# EAGLE design Bit Reactor modular (EAGLE 6.6.0)
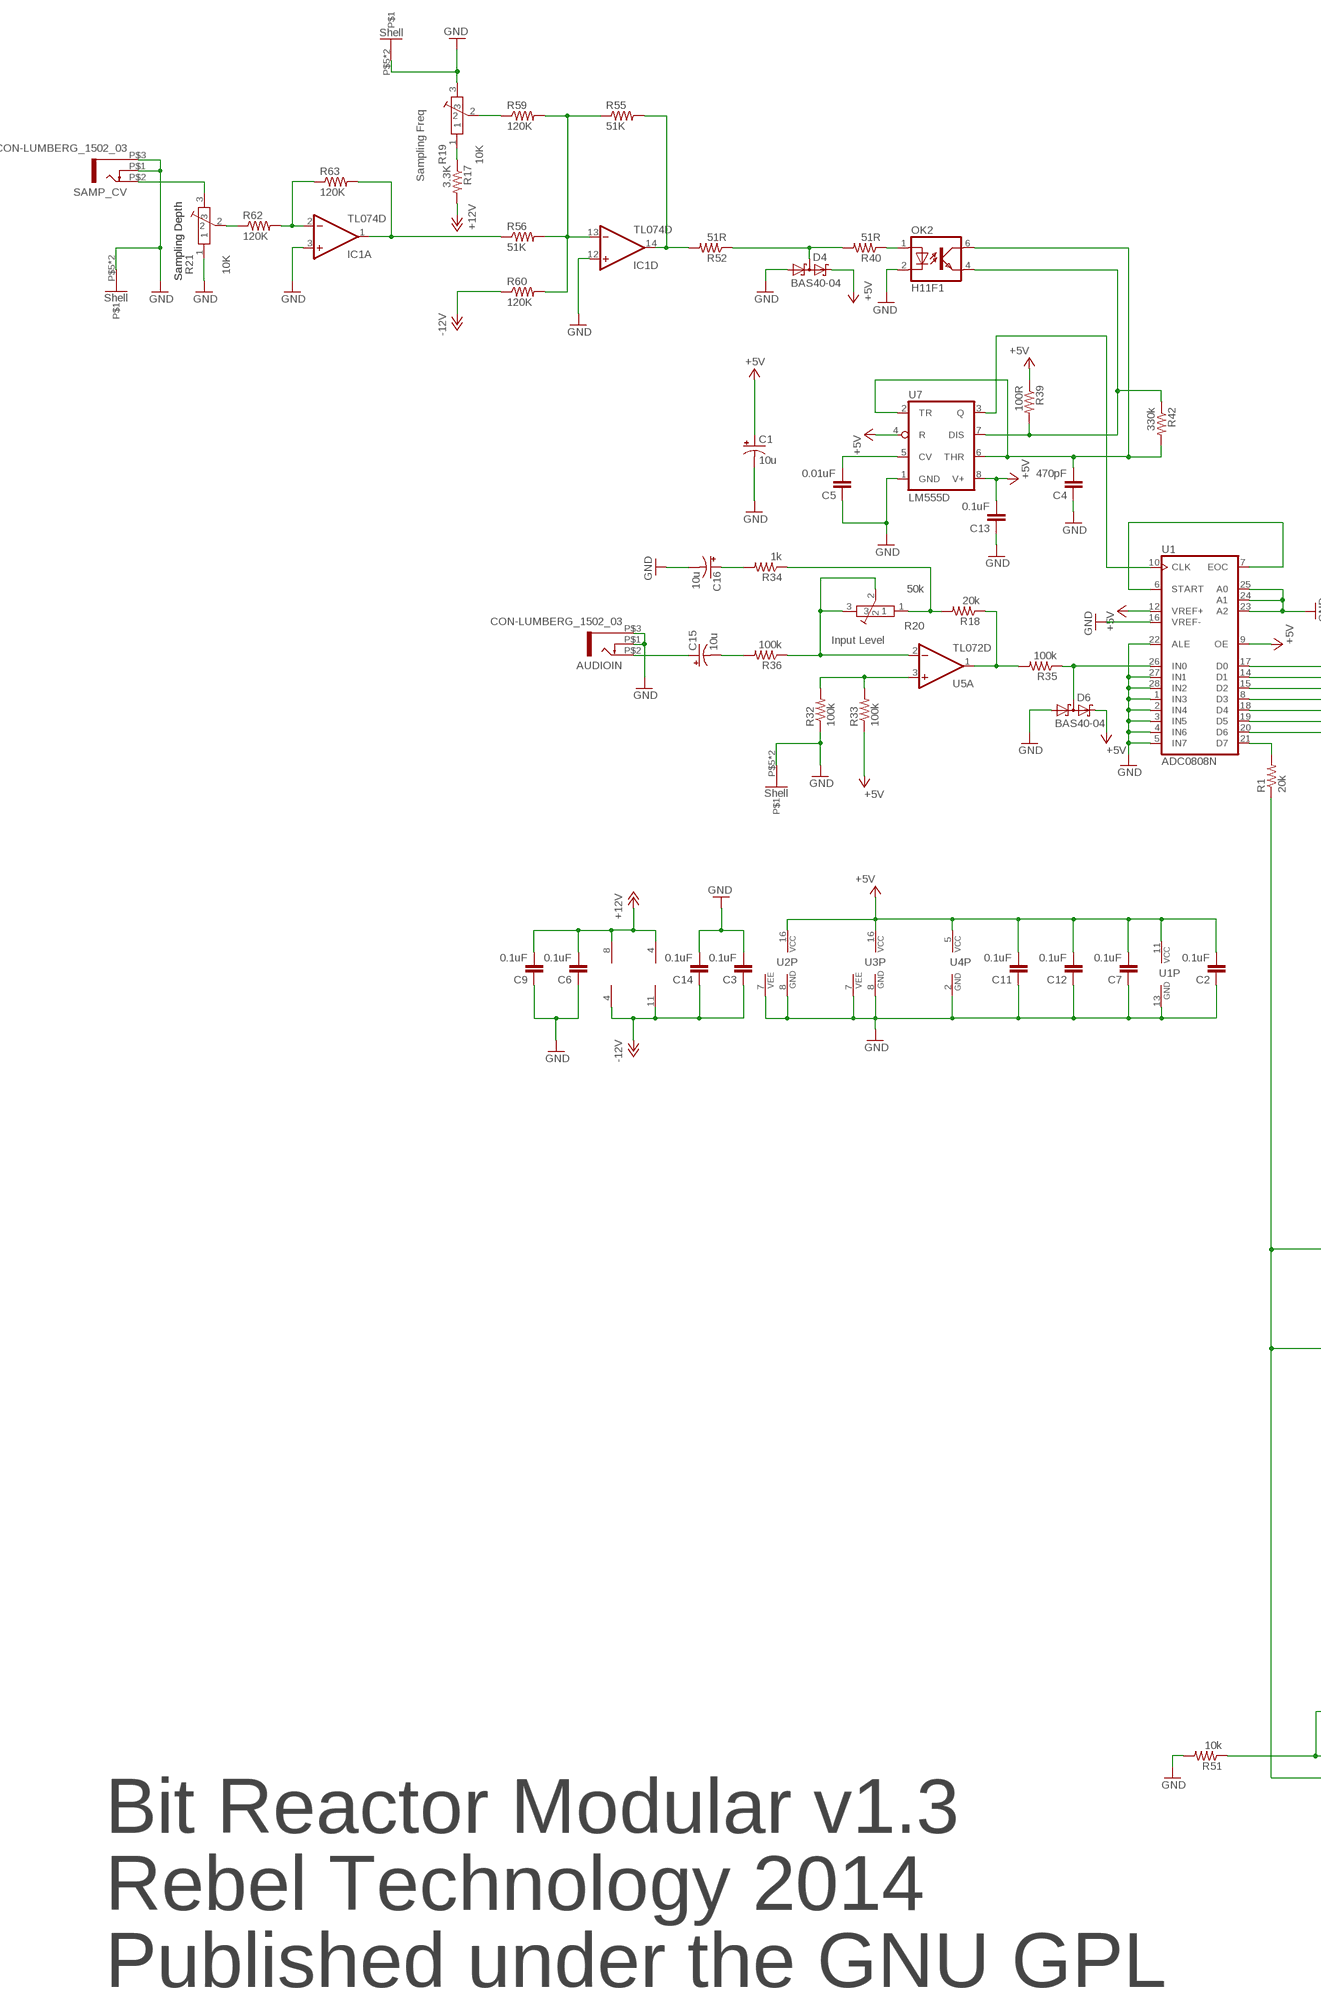
[diagram p0: schematic, sheet 1, part 1 of 2]
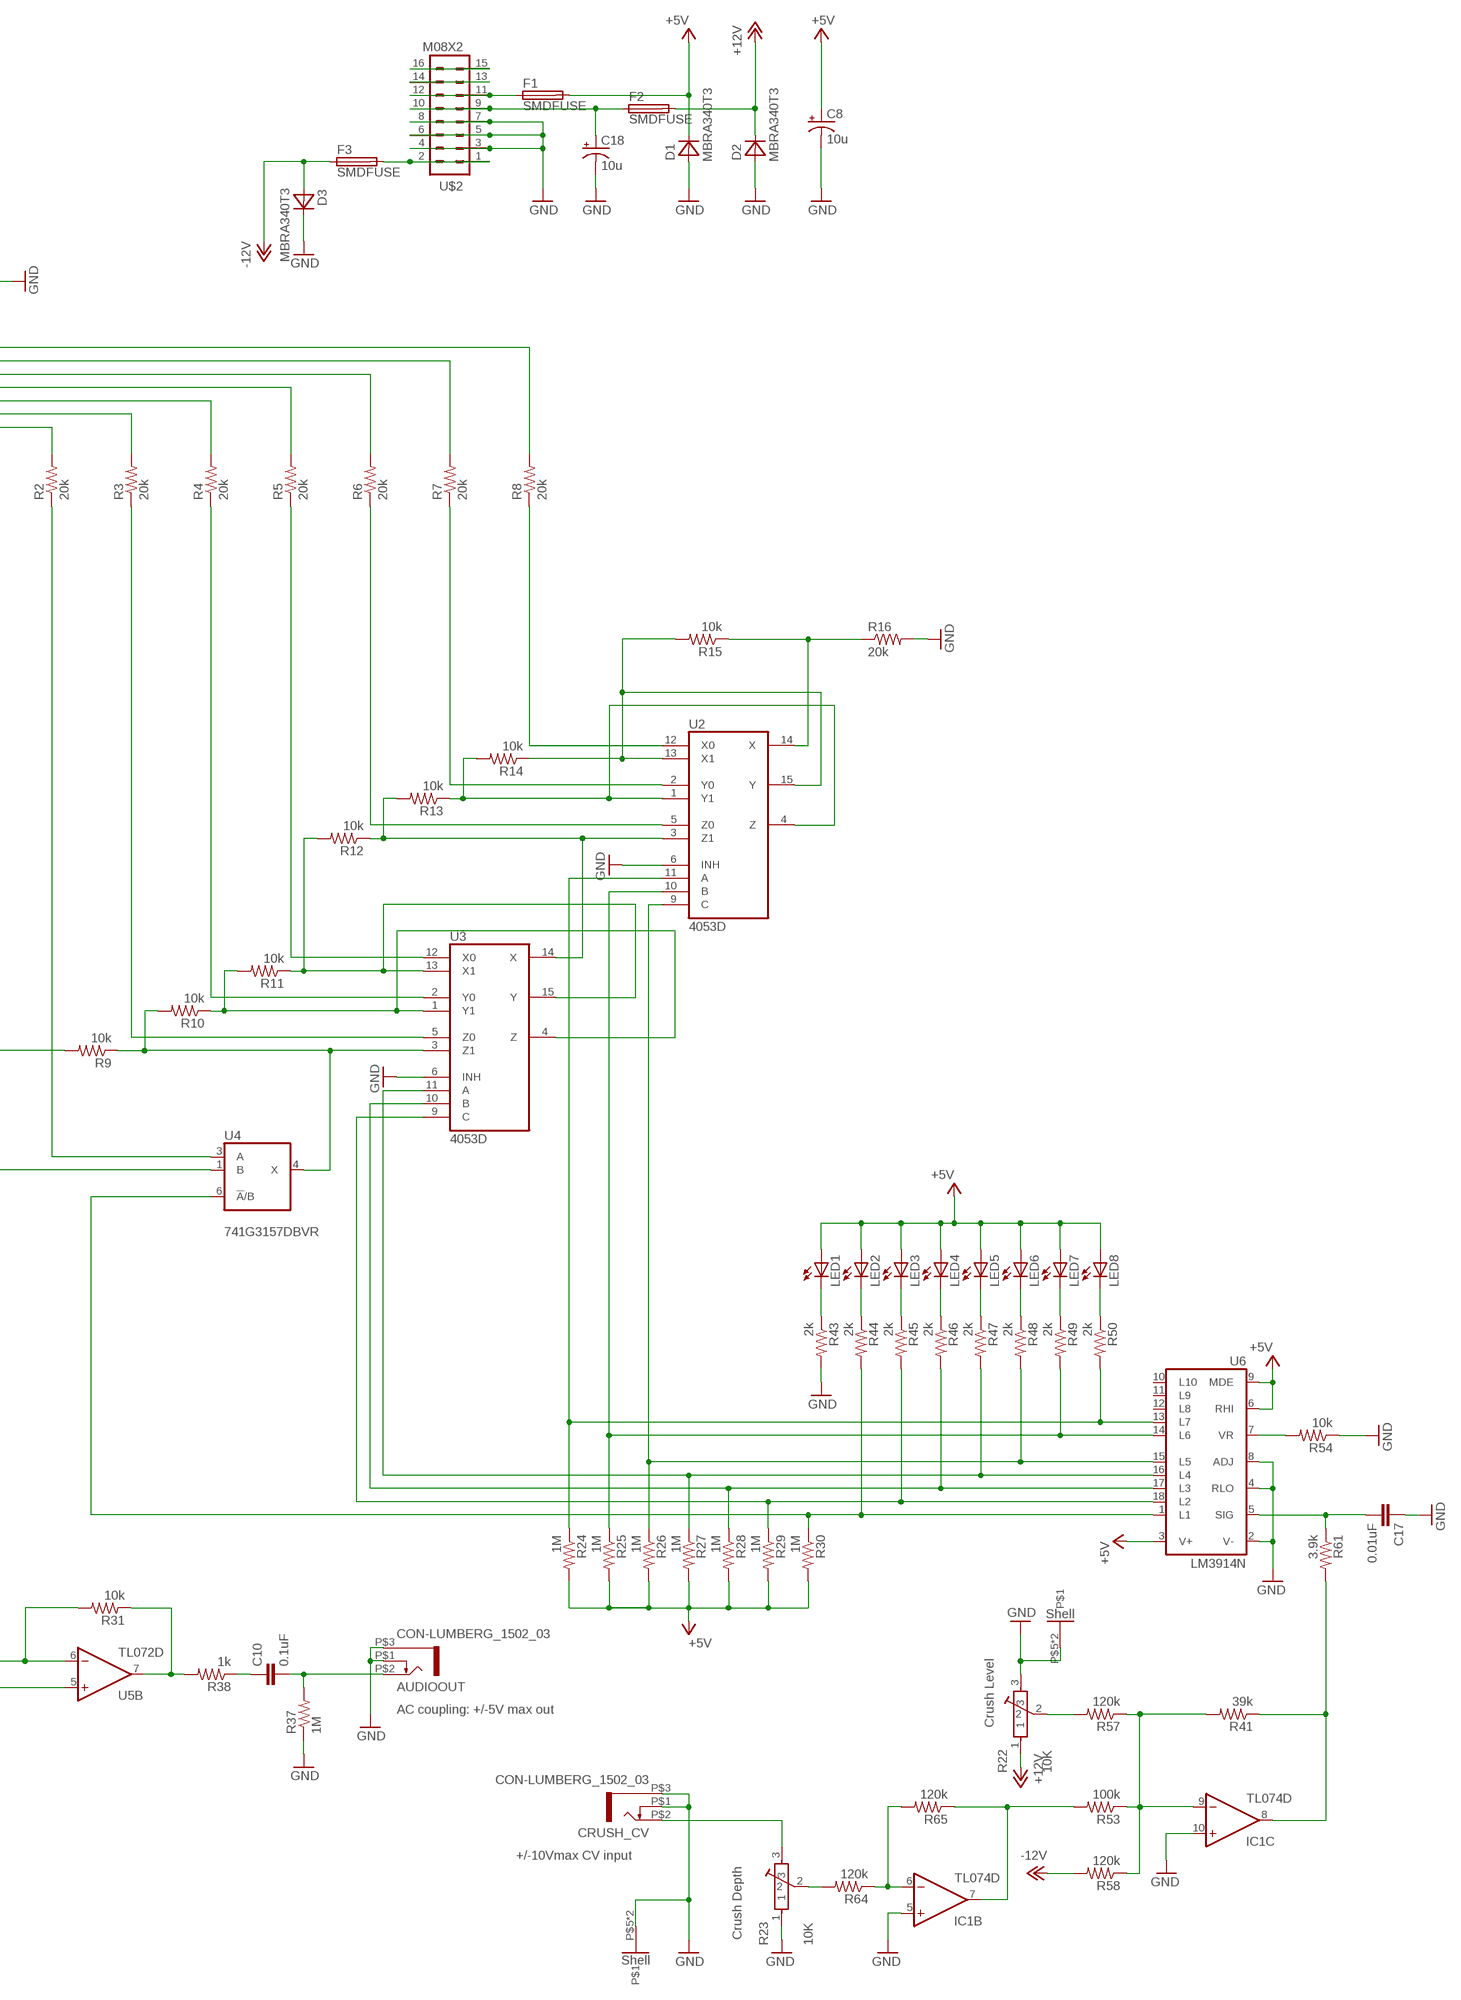
[diagram p1: schematic, sheet 1, part 2 of 2]

## Parts
AUDIOIN  CON-LUMBERG_1502_03  [CON-LUMBERG_1502_03]
AUDIOOUT  CON-LUMBERG_1502_03  [CON-LUMBERG_1502_03]
C1  10u  CPOL-USE2-5  [E2-5]
C2  0.1uF  C-EUC0402  [C0402]
C3  0.1uF  C-EUC0402  [C0402]
C4  470pF  C-EUC0402  [C0402]
C5  0.01uF  C-EUC0402  [C0402]
C6  0.1uF  C-EUC0402  [C0402]
C7  0.1uF  C-EUC0402  [C0402]
C8  10u  CPOL-USE2-5  [E2-5]
C9  0.1uF  C-EUC0402  [C0402]
C10  0.1uF  C-EUC0402  [C0402]
C11  0.1uF  C-EUC0402  [C0402]
C12  0.1uF  C-EUC0402  [C0402]
C13  0.1uF  C-EUC0402  [C0402]
C14  0.1uF  C-EUC0402  [C0402]
C15  10u  CPOL-USE2-5  [E2-5]
C16  10u  CPOL-USE2-5  [E2-5]
C17  0.01uF  C-EUC0402  [C0402]
C18  10u  CPOL-USE2-5  [E2-5]
CRUSH_CV  CON-LUMBERG_1502_03  [CON-LUMBERG_1502_03]
D1  MBRA340T3  [SMA]
D2  MBRA340T3  [SMA]
D3  MBRA340T3  [SMA]
D4  BAS40-04  [SOT23]
D6  BAS40-04  [SOT23]
F1  SMDFUSE  [1206]
F2  SMDFUSE  [1206]
F3  SMDFUSE  [1206]
IC1  TL074D  [SO14]
LED1  LED3MM  [LED3MM]
LED2  LED3MM  [LED3MM]
LED3  LED3MM  [LED3MM]
LED4  LED3MM  [LED3MM]
LED5  LED3MM  [LED3MM]
LED6  LED3MM  [LED3MM]
LED7  LED3MM  [LED3MM]
LED8  LED3MM  [LED3MM]
OK2  H11F1  [DIL05]
R1  20k  R-US_R0805  [R0805]
R2  20k  R-US_R0805  [R0805]
R3  20k  R-US_R0805  [R0805]
R4  20k  R-US_R0805  [R0805]
R5  20k  R-US_R0805  [R0805]
R6  20k  R-US_R0805  [R0805]
R7  20k  R-US_R0805  [R0805]
R8  20k  R-US_R0805  [R0805]
R9  10k  R-US_R0805  [R0805]
R10  10k  R-US_R0805  [R0805]
R11  10k  R-US_R0805  [R0805]
R12  10k  R-US_R0805  [R0805]
R13  10k  R-US_R0805  [R0805]
R14  10k  R-US_R0805  [R0805]
R15  10k  R-US_R0805  [R0805]
R16  20k  R-US_R0805  [R0805]
R17  3.3K  R-US_R0805  [R0805]
R18  20k  R-US_R0805  [R0805]
R19  10K  POT-ALPS-RK09L1140  [POT-ALPS-RK09L1140]
R20  50k  POT-ALPS-RK09L1140  [POT-ALPS-RK09L1140]
R21  10K  POT-ALPS-RK09L1140  [POT-ALPS-RK09L1140]
R22  10K  POT-ALPS-RK09L1140  [POT-ALPS-RK09L1140]
R23  10K  POT-ALPS-RK09L1140  [POT-ALPS-RK09L1140]
R24  1M  R-US_R0402  [R0402]
R25  1M  R-US_R0402  [R0402]
R26  1M  R-US_R0402  [R0402]
R27  1M  R-US_R0402  [R0402]
R28  1M  R-US_R0402  [R0402]
R29  1M  R-US_R0402  [R0402]
R30  1M  R-US_R0402  [R0402]
R31  10k  R-US_R0402  [R0402]
R32  100k  R-US_R0402  [R0402]
R33  100k  R-US_R0402  [R0402]
R34  1k  R-US_R0805  [R0805]
R35  100k  R-US_R0402  [R0402]
R36  100k  R-US_R0402  [R0402]
R37  1M  R-US_R0402  [R0402]
R38  1k  R-US_R0805  [R0805]
R39  100R  R-US_R1206  [R1206]
R40  51R  R-US_R1206  [R1206]
R41  39k  R-US_R0402  [R0402]
R42  330k  R-US_R0402  [R0402]
R43  2k  R-US_R0402  [R0402]
R44  2k  R-US_R0402  [R0402]
R45  2k  R-US_R0402  [R0402]
R46  2k  R-US_R0402  [R0402]
R47  2k  R-US_R0402  [R0402]
R48  2k  R-US_R0402  [R0402]
R49  2k  R-US_R0402  [R0402]
R50  2k  R-US_R0402  [R0402]
R51  10k  R-US_R0402  [R0402]
R52  51R  R-US_R1206  [R1206]
R53  100k  R-US_R0402  [R0402]
R54  10k  R-US_R0805  [R0805]
R55  51K  R-US_R0402  [R0402]
R56  51K  R-US_R0402  [R0402]
R57  120k  R-US_R0402  [R0402]
R58  120k  R-US_R0402  [R0402]
R59  120K  R-US_R0402  [R0402]
R60  120K  R-US_R0402  [R0402]
R61  3.9k  R-US_R0402  [R0402]
R62  120K  R-US_R0402  [R0402]
R63  120K  R-US_R0402  [R0402]
R64  120k  R-US_R0402  [R0402]
R65  120k  R-US_R0402  [R0402]
SAMP_CV  CON-LUMBERG_1502_03  [CON-LUMBERG_1502_03]
U1  ADC0808N  [DIL28-6]
U2  4053D  [SO16]
U3  4053D  [SO16]
U4  741G3157DBVR  [DBV_R-PDSO-G6]
U5  TL072D  [SO08]
U6  LM3914N  [DIL18]
U7  LM555D  [SO08]
U$2  M08X2  [2X8]

## Nets
+5V: C1.+ C2.2 C7.2 C8.+ C11.2 C12.2 C13.2 D1.C D4.2(C2) D6.2(C2) F1.2 LED1.A LED2.A LED3.A LED4.A LED5.A LED6.A LED7.A LED8.A R24.2 R25.2 R26.2 R27.2 R28.2 R29.2 R30.2 R33.1 R39.1 U1.9(OE) U1.11(VCC) U1.12(VREF+) U2.16(VCC) U3.16(VCC) U4.5(VCC) U6.3(V+) U6.6(RHI) U6.9(MDE) U7.4(R) U7.8(V+)
+12V: C6.2 C9.2 D2.C F2.2 IC1.4(P:V+) R17.2 R22.1 U5.8(P:V+)
-12V: C3.1 C14.1 D3.A F3.1 IC1.11(P:V-) R58.2 R60.1 U5.4(P:V-)
CV2IN: IC1.8(C:OUT) R41.1 R61.2
GND: AUDIOIN.P$1 AUDIOIN.P$3 AUDIOOUT.P$1 AUDIOOUT.P$3 C1.- C2.1 C3.2 C4.1 C5.1 C6.1 C7.1 C8.- C9.1 C11.1 C12.1 C13.1 C14.2 C16.- C17.1 C18.- CRUSH_CV.P$1 CRUSH_CV.P$3 D1.A D2.A D3.C D4.1(A1) D6.1(A1) IC1.3(A:+IN) IC1.5(B:+IN) IC1.10(C:+IN) IC1.12(D:+IN) OK2.2(C) R16.2 R19.3 R19.P$5 R19.P$6 R20.P$5 R20.P$6 R21.1 R21.P$5 R21.P$6 R22.3 R22.P$5 R22.P$6 R23.1 R23.P$5 R23.P$6 R32.1 R37.1 R43.2 R51.2 R54.1 SAMP_CV.P$1 SAMP_CV.P$3 U1.1(IN3) U1.2(IN4) U1.3(IN5) U1.4(IN6) U1.5(IN7) U1.13(GND) U1.16(VREF-) U1.22(ALE) U1.23(A2) U1.24(A1) U1.25(A0) U1.27(IN1) U1.28(IN2) U2.6(INH) U2.7(VEE) U2.8(GND) U3.6(INH) U3.7(VEE) U3.8(GND) U4.2(GND) U6.2(V-) U6.4(RLO) U6.8(ADJ) U7.1(GND) U$2.3 U$2.4 U$2.5 U$2.6 U$2.7 U$2.8
N$1: R1.2 U1.21(D7)
N$2: R2.2 U1.20(D6)
N$3: R3.2 U1.19(D5)
N$4: R4.2 U1.18(D4)
N$5: R5.2 U1.8(D3)
N$6: R6.2 U1.15(D2)
N$7: R7.2 U1.14(D1)
N$8: R8.2 U1.17(D0)
N$9: R17.1 R19.1
N$10: AUDIOIN.P$2 C15.+
N$11: C15.- R36.2
N$12: R13.1 R14.2 U2.1(Y1) U2.4(Z)
N$13: R5.1 U3.12(X0)
N$14: R4.1 U3.2(Y0)
N$15: R3.1 U3.5(Z0)
N$16: R2.1 U4.3(A)
N$17: R8.1 U2.12(X0)
N$18: R21.2 R62.1
N$19: IC1.2(A:-IN) R62.2 R63.1
N$20: R18.2 R20.1 R34.1
N$21: R7.1 U2.2(Y0)
N$22: R6.1 U2.5(Z0)
N$23: IC1.1(A:OUT) R56.1 R63.2
N$24: R12.1 R13.2 U2.3(Z1) U3.14(X)
N$25: R11.1 R12.2 U3.13(X1) U3.15(Y)
N$26: R10.1 R11.2 U3.1(Y1) U3.4(Z)
N$27: R9.1 R10.2 U3.3(Z1) U4.4(X)
N$28: R1.1 R9.2 U4.1(B) U5.5(B:+IN)
N$29: OK2.1(A) R40.1
N$30: U$2.13 U$2.14
N$31: R30.1 R44.2 U4.6(!A!/B) U6.1(L1)
N$32: R29.1 R45.2 U3.9(C) U6.18(L2)
N$33: R28.1 R46.2 U3.10(B) U6.17(L3)
N$34: R27.1 R47.2 U3.11(A) U6.16(L4)
N$35: R26.1 R48.2 U2.9(C) U6.15(L5)
N$36: R25.1 R49.2 U2.10(B) U6.14(L6)
N$37: R24.1 R50.2 U2.11(A) U6.13(L7)
N$38: R18.1 R35.2 U5.1(A:OUT)
N$39: R32.2 R33.2 U5.3(A:+IN)
N$40: R20.2 R20.3 R36.1 U5.2(A:-IN)
N$41: F1.1 U$2.11 U$2.12
N$42: R23.2 R64.2
N$43: R31.1 R38.2 U5.7(B:OUT)
N$44: C10.1 R38.1
N$45: U1.6(START) U1.7(EOC)
N$47: IC1.6(B:-IN) R64.1 R65.2
N$48: CRUSH_CV.P$2 R23.3
N$49: IC1.7(B:OUT) R53.2 R65.1
N$51: C18.+ F2.1 U$2.9 U$2.10
N$52: C5.2 U7.5(CV)
N$53: LED1.K(C) R43.1
N$54: U1.10(CLK) U7.3(Q)
N$55: R31.2 R51.1 U5.6(B:-IN)
N$56: LED2.K(C) R44.1
N$57: LED3.K(C) R45.1
N$58: LED4.K(C) R46.1
N$59: LED5.K(C) R47.1
N$60: LED6.K(C) R48.1
N$61: LED7.K(C) R49.1
N$62: LED8.K(C) R50.1
N$63: D6.3(C1A2) R35.1 U1.26(IN0)
N$65: R14.1 R15.2 U2.13(X1) U2.15(Y)
N$68: C16.+ R34.2
N$70: F3.2 U$2.1 U$2.2
N$71: IC1.13(D:-IN) R55.1 R56.2 R59.2 R60.2
N$72: R19.2 R59.1
N$73: IC1.14(D:OUT) R52.2 R55.2
N$75: R21.3 SAMP_CV.P$2
N$79: R54.2 U6.7(VR)
N$80: C17.2 R61.1 U6.5(SIG)
N$81: IC1.9(C:-IN) R41.2 R53.1 R57.1 R58.1
N$82: D4.3(C1A2) R40.2 R52.1
N$83: R22.2 R57.2
N$85: R15.1 R16.1 U2.14(X)
OUT: AUDIOOUT.P$2 C10.2 R37.2
PWR_BUS: U$2.15 U$2.16
Y: OK2.4(EMIT) R39.2 R42.1 U7.7(DIS)
Z: C4.2 OK2.6(COL) R42.2 U7.2(TR) U7.6(THR)
Unconnected: U6.10(L10) U6.11(L9) U6.12(L8)

## Notes on the sheet
- Sampling Freq
- Sampling Depth | Sampling Depth
- Input Level
- AC coupling: +/-5V max out
- Crush Level
- Bit Reactor Modular v1.3
- Rebel Technology 2014
- +/-10Vmax CV input
- Published under the GNU GPL | Crush Depth

## Library data of the parts
AUDIOIN AUDIOOUT CRUSH_CV SAMP_CV = Rebel:CON-LUMBERG_1502_03
C1 C8 C15 C16 C18 = resistor:CPOL-US: POLARIZED CAPACITOR, American symbol
C2-C7 C9-C14 C17 = resistor:C-EU: CAPACITOR, European symbol
D1-D3 = diode:MBRA340T3: Surface Mount Schottky Power Rectifier Source: http://www.onsemi.com/pub_link/Collateral/MBRA340T3-D.PDF
D4 D6 = diode:BAS40-04: Silicon Schottky Diodes General-purpose diode for high-speed switching
F1-F3 = fuse:SMDFUSE
IC1 = linear:TL074: OP AMP
LED1-LED8 = led:LED: LED OSRAM: - CHIPLED LG R971, LG N971, LY N971, LG Q971, LY Q971, LO R971, LY R971 LH N974, LH R974 LS Q976, LO Q976, LY Q976 LO Q996 - Hyper CHIPLED LW Q18S LB Q993, LB Q99A, LB R99A - SideLED LS A670, LO A670, LY A670, LG A670, LP A670 LB A673, LV A673, LT A673, LW A673 LH A674 LY A675 LS A676, LA A676, LO A676, LY A676, LW A676 LS A679, LY A679, LG A679 - Hyper Micro SIDELED® LS Y876, LA Y876, LO Y876, LY Y876 LT Y87S - SmartLED LW L88C, LW L88S LB L89C, LB L89S, LG L890 LS L89K, LO L89K, LY L89K LS L896, LA L896, LO L896, LY L896 - TOPLED LS T670, LO T670, LY T670, LG T670, LP T670 LSG T670, LSP T670, LSY T670, LOP T670, LYG T670 LG T671, LOG T671, LSG T671 LB T673, LV T673, LT T673, LW T673 LH T674 LS T676, LA T676, LO T676, LY T676, LB T676, LH T676, LSB T676, LW T676 LB T67C, LV T67C, LT T67C, LS T67K, LO T67K, LY T67K, LW E67C LS E67B, LA E67B, LO E67B, LY E67B, LB E67C, LV E67C, LT E67C LW T67C LS T679, LY T679, LG T679 LS T770, LO T770, LY T770, LG T770, LP T770 LB T773, LV T773, LT T773, LW T773 LH T774 LS E675, LA E675, LY E675, LS T675 LS T776, LA T776, LO T776, LY T776, LB T776 LHGB T686 LT T68C, LB T68C - Hyper Mini TOPLED® LB M676 - Mini TOPLED Santana® LG M470 LS M47K, LO M47K, LY M47K Source: http://www.osram.convergy.de LUXEON: - LUMILED® LXK2-PW12-R00, LXK2-PW12-S00, LXK2-PW14-U00, LXK2-PW14-V00 LXK2-PM12-R00, LXK2-PM12-S00, LXK2-PM14-U00 LXK2-PE12-Q00, LXK2-PE12-R00, LXK2-PE12-S00, LXK2-PE14-T00, LXK2-PE14-U00 LXK2-PB12-K00, LXK2-PB12-L00, LXK2-PB12-M00, LXK2-PB14-N00, LXK2-PB14-P00, LXK2-PB14-Q00 LXK2-PR12-L00, LXK2-PR12-M00, LXK2-PR14-Q00, LXK2-PR14-R00 LXK2-PD12-Q00, LXK2-PD12-R00, LXK2-PD12-S00 LXK2-PH12-R00, LXK2-PH12-S00 LXK2-PL12-P00, LXK2-PL12-Q00, LXK2-PL12-R00 Source: www.luxeon.com KINGBRIGHT: KA-3528ASYC Source: www.kingbright.com
OK2 = optocoupler:H11F1: OPTO COUPLER OPTO COUPLER; OC_FARNELL: unknown; OC_NEWARK: unknown
R1-R18 R24-R65 = resistor:R-US_: RESISTOR, American symbol
R19-R23 = Rebel:POT-ALPS-RK09L
U1 = linear:ADC0808: 8-bit A/D CONVERTER with 8-channel multiplexer
U2 U3 = 40xx:4053: Triple 2-channel ANALOG MULTIPLEXER
U4 = 74xx-little-us:74*1G3157: Single-Pole, Double-Throw Analog Switch Source: http://focus.ti.com/lit/ds/symlink/sn74lvc1g3157.pdf
U5 = linear:TL072: OP AMP
U6 = linear:LM3914N: LED DRIVER senses analog voltage levels and drives 10 LEDs
U7 = linear:*555: TIMER
U$2 = SparkFun:M08X2

## Board
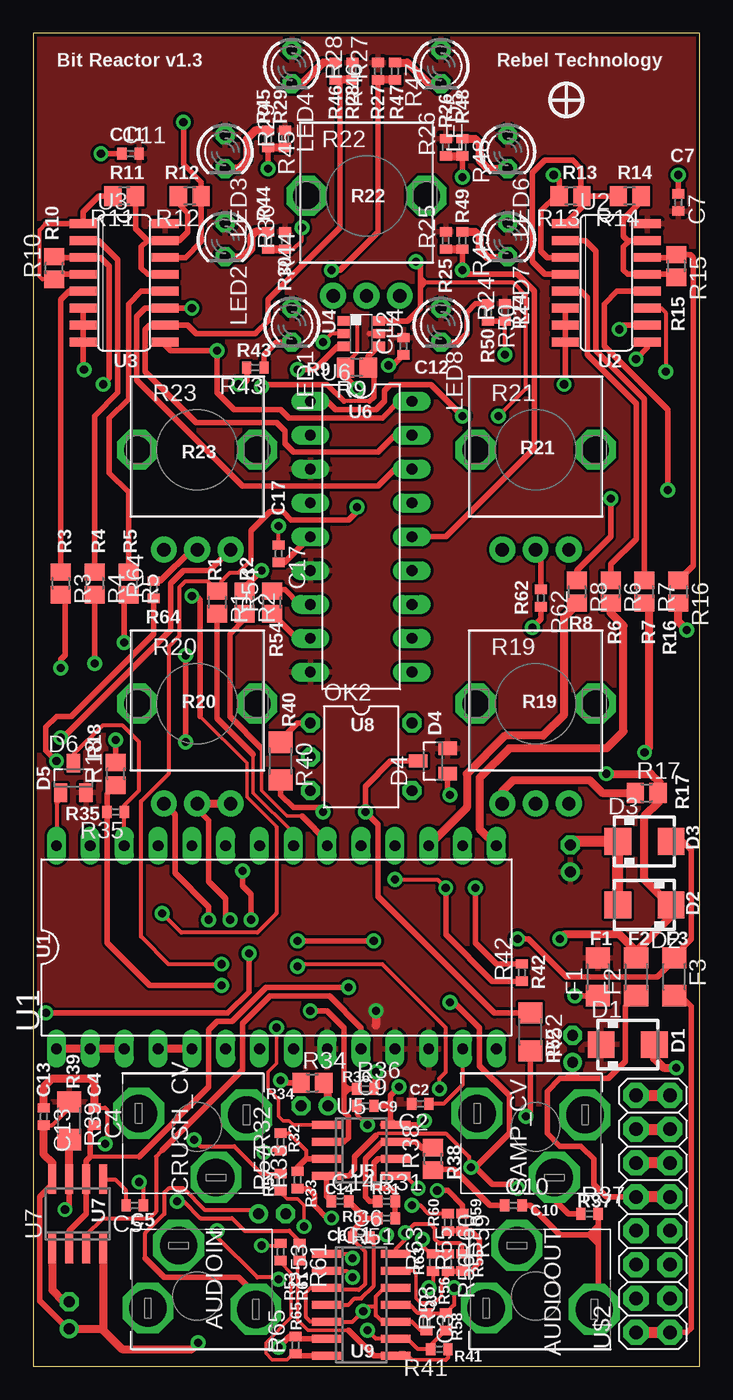
[diagram p2: board, top side]
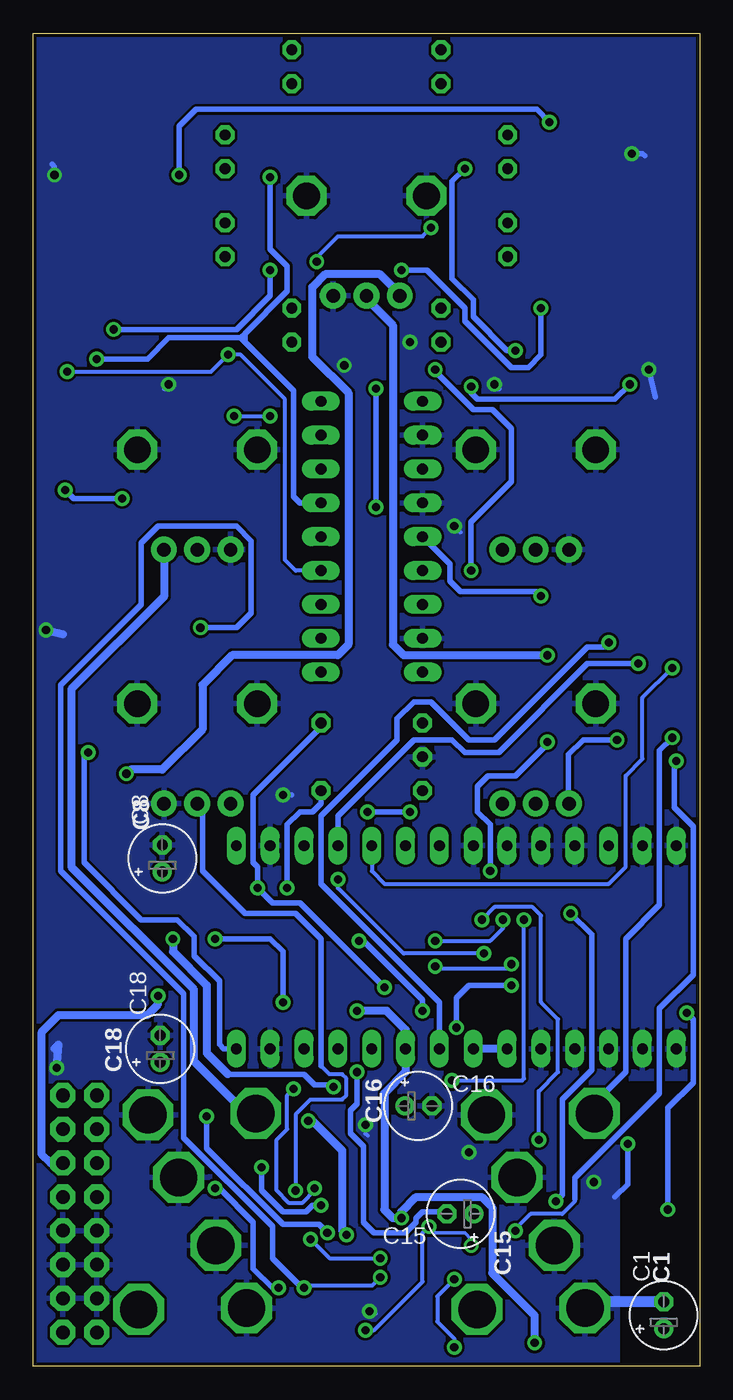
[diagram p3: board, bottom side, seen from below]

Size 50 x 100 mm. Coordinates in mm from the lower left corner, seen from the top.
Outline: 50,0 50,100 0,100 0,0 50,0
Copper layers (1*16): Top 0.035mm / dielectric 1.5mm / Bottom 0.035mm
Design rules "SparkFun": minimum track width 8mil, minimum drill 20mil, track to track 8mil, track to pad 8mil, pad to pad 8mil, via to via 8mil, smd to smd 8mil, copper to edge 10mil, drill to drill 8mil, minimum pad ring 12mil, minimum via ring 10mil, stop-mask expansion 4mil, vias tented up to drill 25mil, thermal gap 10mil

### Footprints (pad centres in the part's own frame; a part is rotated, then mirrored left to right if it is on the bottom)
CON-LUMBERG_1502_03 = drill 2.8 octagon: P$1 -3.8,-1.4; P$2 1,4.4; P$3 0.9,-3.7
E2-5 = drill 0.813 pad 1.27: + -1.016,0 | drill 0.813 pad 1.27 octagon: - 1.016,0
C0402 = smd 0.7 x 0.9: 1 -0.65,0; 2 0.65,0
SMA = smd 2 x 2: A 2,0; C -2,0
SOT23 = smd 1 x 1.4: 1 -0.95,-1.1; 2 0.95,-1.1; 3 0,1.1
1206 = smd 1.6 x 1.803: 1 -1.422,0; 2 1.422,0
SO14 = smd 0.6 x 2.2: 1 -3.81,-2.6; 2 -2.54,-2.6; 3 -1.27,-2.6; 4 0,-2.6; 5 1.27,-2.6; 6 2.54,-2.6; 7 3.81,-2.6; 8 3.81,2.6; 9 2.54,2.6; 10 1.27,2.6; 11 0,2.6; 12 -1.27,2.6; 13 -2.54,2.6; 14 -3.81,2.6
LED3MM = drill 0.813 octagon: A -1.27,0; K 1.27,0
DIL05 = drill 0.813 octagon: 1 -2.54,-3.81; 2 0,-3.81; 3 2.54,-3.81; 4 2.54,3.81; 6 -2.54,3.81
R0805 = smd 1.3 x 1.5: 1 -0.85,0; 2 0.85,0
POT-ALPS-RK09L1140 = drill 1 pad 1.93: 1 -2.5,-7.5; 2 0,-7.5; 3 2.5,-7.5 | drill 2 octagon: P$5 -4.5,0; P$6 4.5,0
R0402 = smd 0.7 x 0.9: 1 -0.65,0; 2 0.65,0
R1206 = smd 1.6 x 1.803: 1 -1.422,0; 2 1.422,0
DIL28-6 = drill 0.813 long: 1 -16.51,-7.62; 2 -13.97,-7.62; 3 -11.43,-7.62; 4 -8.89,-7.62; 5 -6.35,-7.62; 6 -3.81,-7.62; 7 -1.27,-7.62; 8 1.27,-7.62; 9 3.81,-7.62; 10 6.35,-7.62; 11 8.89,-7.62; 12 11.43,-7.62; 13 13.97,-7.62; 14 16.51,-7.62; 15 16.51,7.62; 16 13.97,7.62; 17 11.43,7.62; 18 8.89,7.62; 19 6.35,7.62; 20 3.81,7.62; 21 1.27,7.62; 22 -1.27,7.62; 23 -3.81,7.62; 24 -6.35,7.62; 25 -8.89,7.62; 26 -11.43,7.62; 27 -13.97,7.62; 28 -16.51,7.62
SO16 = smd 0.66 x 2.032: 1 -4.445,-3.073; 2 -3.175,-3.073; 3 -1.905,-3.073; 4 -0.635,-3.073; 5 0.635,-3.073; 6 1.905,-3.073; 7 3.175,-3.073; 8 4.445,-3.073; 9 4.445,3.073; 10 3.175,3.073; 11 1.905,3.073; 12 0.635,3.073; 13 -0.635,3.073; 14 -1.905,3.073; 15 -3.175,3.073; 16 -4.445,3.073
DBV_R-PDSO-G6 = smd 0.69 x 0.99: 1 -0.95,-1.29; 2 0,-1.29; 3 0.95,-1.29; 4 0.95,1.3; 5 0,1.3; 6 -0.95,1.3
SO08 = smd 0.6 x 2.2: 1 -1.905,-2.6; 2 -0.635,-2.6; 3 0.635,-2.6; 4 1.905,-2.6; 5 1.905,2.6; 6 0.635,2.6; 7 -0.635,2.6; 8 -1.905,2.6
DIL18 = drill 0.813 long: 1 -10.16,-3.81; 2 -7.62,-3.81; 3 -5.08,-3.81; 4 -2.54,-3.81; 5 0,-3.81; 6 2.54,-3.81; 7 5.08,-3.81; 8 7.62,-3.81; 9 10.16,-3.81; 10 10.16,3.81; 11 7.62,3.81; 12 5.08,3.81; 13 2.54,3.81; 14 0,3.81; 15 -2.54,3.81; 16 -5.08,3.81; 17 -7.62,3.81; 18 -10.16,3.81
2X8 = drill 1.016 pad 1.88 octagon: 1 0,0; 2 0,2.54; 3 2.54,0; 4 2.54,2.54; 5 5.08,0; 6 5.08,2.54; 7 7.62,0; 8 7.62,2.54; 9 10.16,0; 10 10.16,2.54; 11 12.7,0; 12 12.7,2.54; 13 15.24,0; 14 15.24,2.54; 15 17.78,0; 16 17.78,2.54

### Placement (x,y rotation side)
AUDIOIN  12.3,5.26 270 top
AUDIOOUT  37.7,5.26 270 top
C1  2.69,3.81 90 bottom
C2  29.04,19.68 180 top
C3  29.52,3.33 270 top
C4  4.6,18.73 270 top
C5  7.61,12.06 180 top
C6  24.6,9.68 0 top
C7  48.41,87.31 270 top
C8  40.32,38.1 90 bottom
C9  24.92,19.53 0 top
C10  36.03,12.06 0 top
C11  7.3,90.96 0 top
C12  27.77,76.52 90 top
C13  0.79,18.73 270 top
C14  23.01,12.38 0 top
C15  17.93,11.43 180 bottom
C16  21.11,19.53 0 bottom
C17  18.41,60.96 270 top
C18  40.48,23.81 90 bottom
CRUSH_CV  12.3,17.96 90 top
D1  44.6,24.13 0 top
D2  45.87,34.61 180 top
D3  45.87,39.37 0 top
D4  30,45.4 90 top
D6  3.01,44.13 0 top
F1  42.38,29.21 90 top
F2  45.24,29.21 90 top
F3  48.09,29.21 270 top
IC1  24.6,4.6 270 top
LED1  19.4,78.1 270 top
LED2  14.4,84.51 270 top
LED3  14.4,91.11 270 top
LED4  19.4,97.5 270 top
LED5  30.6,97.5 270 top
LED6  35.6,91.11 270 top
LED7  35.6,84.51 270 top
LED8  30.6,78.1 270 top
OK2  24.6,45.72 270 top
R1  13.8,57.31 270 top
R2  15.87,57.31 270 top
R3  2.06,58.74 270 top
R4  4.6,58.74 270 top
R5  7.14,58.74 270 top
R6  43.33,58.1 270 top
R7  45.87,58.1 270 top
R8  40.79,58.1 270 top
R9  24.28,74.93 180 top
R10  1.58,82.39 90 top
R11  6.82,87.79 180 top
R12  11.74,87.79 180 top
R13  40.32,87.79 180 top
R14  44.76,87.79 180 top
R15  48.25,82.55 270 top
R16  48.41,58.1 270 top
R17  46.03,43.02 0 top
R18  6.19,44.45 90 top
R19  37.7,49.71 0 top
R20  12.3,49.71 0 top
R21  37.7,68.76 0 top
R22  25,87.81 0 top
R23  12.3,68.76 0 top
R24  35.39,79.06 90 top
R25  30.95,84.45 90 top
R26  30.95,91.44 90 top
R27  25.87,97.16 90 top
R28  23.96,97.16 90 top
R29  18.88,92.08 90 top
R30  18.88,84.45 90 top
R31  26.5,12.38 0 top
R32  18.57,16.83 90 top
R33  19.84,13.97 90 top
R34  20.95,21.27 0 top
R35  6.19,41.59 180 top
R36  24.92,20.8 0 top
R37  41.74,11.43 0 top
R38  30,15.56 90 top
R39  2.69,18.41 270 top
R40  18.57,45.4 270 top
R41  30.47,1.27 180 top
R42  36.66,29.53 90 top
R43  16.66,74.93 180 top
R44  17.61,84.45 270 top
R45  17.61,92.08 270 top
R46  22.7,97.16 270 top
R47  27.14,97.16 270 top
R48  32.22,91.44 270 top
R49  32.22,84.45 270 top
R50  34.12,79.06 270 top
R51  26.5,11.11 180 top
R52  37.3,25.08 270 top
R53  18.57,8.57 270 top
R54  17.93,57.31 90 top
R55  32.22,7.78 90 top
R56  31.11,7.78 270 top
R57  18.57,13.81 90 top
R58  30.95,3.33 90 top
R59  32.22,10.79 270 top
R60  31.11,10.79 270 top
R61  20,8.57 270 top
R62  38.09,57.63 270 top
R63  30,7.78 90 top
R64  9.04,58.26 90 top
R65  19.68,1.59 90 top
SAMP_CV  37.7,17.96 90 top
U1  18.25,31.43 0 top
U2  43.02,81.28 270 top
U3  6.82,81.28 270 top
U4  24.6,77.47 270 top
U5  24.6,16.19 270 top
U6  24.6,62.23 270 top
U7  3.33,11.43 0 top
U$2  47.78,2.54 90 top

### Tracks (layer width: path | path; a pad name or v marks a point on that pad's centre or on a via)
+5V  (via drill 0.61)
  Top 0.305: C13.2 1.41,18.08 2.53,19.21 2.53,19.68 R39.1
  Top 0.406: 25.23,77.47 25.87,77.47 | U7.8 1.42,13.65 0.47,12.7 0.47,4.92 2.6,2.79 C1.+ | v22.38,11.11 22.06,11.11 21.11,12.06 21.11,12.86 20.65,13.32 R33.1
  Top 0.61: R39.1 3.01,19.68 | U7.8 1.42,15.24 0.79,15.88 C13.2 0.79,18.1 | U7.4 5.23,2.86 | 5.23,2.86 5.23,2.7 6.66,1.27 11.9,1.27 v12.38,1.75 | v25.71,26.67 25.71,25.56 | C1.+ 5.17,2.79 5.23,2.86
  Bottom 0.61: v12.38,1.75 12.38,3.81 15.55,6.99 15.55,11.91 16.34,12.7 21.27,12.7 22.38,11.59 v22.38,11.11 23.01,11.11 23.65,11.75 23.65,20.48 22.06,22.07 U1.9 22.06,25.24 23.49,26.67 v25.71,26.67
  pour Top: -0.17,99.69 -0.17,19.68 50,19.68 50,99.69
+12V  (via drill 0.61)
  Top 0.305: 27.14,18.1 U5.8 | 25.23,9.67 C6.2 | 25.39,9.54 C6.2 | C6.2 25.55,9.38 25.55,6.03 24.6,5.08 24.12,5.08 23.65,4.6 IC1.4
  Top 0.406: 26.82,19.84 26.82,19.21 | 26.82,19.21 26.82,18.48 U5.8 | 26.5,19.53 26.82,19.84 | 26.82,19.21 26.5,19.53 | 26.19,18.1 U5.8 | v29.36,18.41 29.04,18.1 U5.8 | 26.82,19.84 26.82,20.32 v27.46,20.95 | 26.5,19.53 C9.2 | C6.2 26.35,9.68 v26.5,9.84
  Top 0.61: 45.24,31.11 47.78,33.66 47.78,34.51 | 47.78,34.51 D2.C | 47.78,34.51 47.78,34.61 45.87,36.51 45.87,41.27 46.98,42.39 46.98,42.92 R17.2 46.98,43.12 46.98,43.81 46.35,44.45 v43.01,44.45 | F2.2 45.24,31.11 | 45.24,31.11 43.97,32.38 39.84,32.38 v39.52,32.07
  Bottom 0.406: 35.39,21.91 29.68,21.91 28.89,21.11 27.62,21.11 v27.46,20.95
  Bottom 0.61: 35.39,21.91 36.98,23.5 36.98,28.57 39.52,31.11 v39.52,32.07 | v29.36,18.41 29.04,18.41 26.82,16.19 26.82,10.16 v26.5,9.84 | R22.1 22.5,80.45 23.96,81.92 28.09,81.92 29.04,80.96 29.04,75.72 26.35,73.03 26.35,54.13 27.14,53.34 35.08,53.34 37.3,51.12 37.3,47.78 40.32,44.77 42.7,44.77 v43.01,44.45
-12V  (via drill 0.61)
  Top 0.254: 25.71,17.3 25.87,17.46 28.57,17.46
  Top 0.305: v28.41,12.06 29.04,12.06 29.66,11.45 R60.1 | 36.98,32.07 37.14,32.07 | R58.2 C3.1 28.87,3.98 28.25,4.6 IC1.11 | 28.57,17.46 30.95,17.46 32.7,15.72 32.7,15.08 v32.85,14.92 | v31.58,5.87 31.58,4.6 31.57,4.6 R58.2 | 31.11,4.13 30.96,4.13 R58.2
  Top 0.406: D3.A 48.73,39.37 49.36,38.73 49.36,32.07 48.09,30.8 F3.1 48.09,30.48 46.82,29.21 40,29.21 37.14,32.07 | 36.98,32.07 v36.35,32.07 | v31.27,27.3 31.58,27.3 33.49,25.4 33.49,22.54 35.71,20.32 35.71,17.46 33.17,14.92 | 22.36,12.4 22,12.76 U5.4 23.65,14.29 24.12,14.76 24.12,15.72 25.71,17.3 | 22.36,12.4 22.38,12.38 | 22.36,12.4 C14.1 22.38,12.37 | v32.85,14.92 33.17,14.92 | 33.17,14.92 34.44,13.65 36.03,13.65 v36.35,13.34
  Bottom 0.406: v36.35,32.07 32.22,32.07 31.27,31.11 v31.27,27.3 | v36.35,13.34 36.03,13.34 33.49,10.79 33.49,7.3 32.06,5.87 v31.58,5.87 | v32.85,14.92 32.85,13.18 31.27,11.59 29.52,11.59 29.04,12.06 v28.41,12.06
CV2IN
  Top 0.254: 30.95,0.48 28.41,0.48 | 23.65,2.7 20.63,2.7 19.84,3.49 19.84,7.78 20,7.94 R61.2 20.01,7.92
  Top 0.305: R41.1 31.12,0.65 30.95,0.48 | 28.41,0.48 27.93,0.95 27.46,0.95 27.3,0.79 IC1.8
  Top 0.406: IC1.8 25.55,0.79 23.65,2.7
GND  (via drill 0.61)
  Top 0.254: 23.95,10.13 C6.1
  Top 0.305: U4.2 22.38,77.47 v21.74,76.83 | U1.13 32.22,21.11 30.79,19.68 C2.1 29.68,19.68 | C9.1 24.27,18.91 v25.08,18.1 | D6.1 2.06,42.55 1.74,42.23 U1.28 | C4.1 5.38,19.38 5.55,19.21 5.55,16.83 v5.39,16.67 | C17.1 v18.41,63.02 | C5.1 8.26,13.48 v7.93,13.81 | 25.71,4.45 25.71,3.81 26.19,3.33 IC1.10 28.41,3.33 29.04,2.7 29.52,2.7 C3.2 | C6.1 23.96,9.53 24.92,8.57 24.92,6.19 24.44,5.71 22.16,5.71 IC1.3 20.79,5.87 20.47,5.56 20.47,3.65 20.79,3.33 IC1.5 23.96,3.33 v24.76,4.13 25.08,4.45 25.71,4.45 | R32.1 17.44,16.18 v17.3,16.03 | 25.71,4.45 25.71,5.24 26.35,5.87 IC1.12
  Top 0.406: U2.6 U2.7 U2.8 39.94,73.76 v39.84,73.66 | U3.8 3.75,78 | 3.75,78 3.64,78.11 | 3.75,78 U3.7 U3.6 | U3.8 3.64,76.83 | R43.2 16.03,74.92 16.03,73.98 15.71,73.66 v15.39,73.66 | U1.28 | R37.1 40.16,11.43 39.2,12.38 39.2,14.05 SAMP_CV.P$1 | R51.2 24.93,11.11 | 24.93,11.11 C14.2 | 23.95,10.13 24.93,11.11 | D4.1 31.1,43.03 v31.27,42.86 | C7.1 v48.41,89.38 | U3.8 3.75,74.83 v3.8,74.77 | C11.1 v5.07,90.96 | C12.1 27.76,75.87 26.98,75.09 v26.66,75.09 | U6.8 19.78,54.61 R54.1
  Top 0.61: U1.5 U1.4 | U1.3 U1.2 U1.1 | C13.1 0.79,20.95 1.42,21.59 4.28,21.59 4.6,21.27 C4.1 | v49.05,55.24 48.41,55.88 R16.2 | U7.1 1.42,5.71 2.22,4.92 2.6,4.92 C1.- | D1.A 46.6,23.08 47.3,22.38 v48.25,22.38
  Top 0.813: D2.A D3.C 40.63,39.37 40.32,39.05 C8.-
  Bottom 0.305: v25.08,18.1 25.08,17.46 24.92,17.3 | v18.41,63.02 17.93,62.55 | v24.76,4.13 24.6,4.29 24.28,3.97
  Bottom 0.406: v39.84,73.66 40.16,73.34 | v3.8,74.77 3.33,72.71 | v15.39,73.66 15.07,73.34 | v31.27,42.86 30.63,42.86 | v5.39,16.67 5.39,13.65 6.34,12.7 | v48.41,89.38 48.41,90.01 48.57,90.17 | v5.07,90.96 4.28,90.96 4.12,90.81
  Bottom 0.61: v48.25,22.38 48.09,24.13 48.41,23.81 | v49.05,55.24 47.78,54.93
  Bottom 0.813: C1.- 8.13,4.83 AUDIOIN.P$3
  pour Bottom: 6.19,0 6.19,21.59 0.47,21.59 0.47,99.69 50,99.69 50,0
N$1
  Top 0.254: U1.21 19.52,40.01 16.5,43.02 16.5,45.88
  Top 0.406: 16.5,45.88 13.8,48.58 R1.2
N$2
  Top 0.254: 20.15,41.27 19.04,41.27 17.14,43.18 17.14,46.35
  Top 0.305: R2.2 16.29,56.46 16.34,56.52
  Top 0.406: U1.20 22.06,39.37 20.15,41.27 | 16.34,56.52 16.34,56.62 | 17.14,46.35 14.76,48.74 14.76,54.93 15.87,56.04 R2.2
N$3  (via drill 0.61)
  Top 0.406: v2.06,52.39 2.06,53.02 2.37,53.34 2.37,57.78 2.06,58.1 R3.2
  Bottom 0.305: U1.19 24.6,37.15 23.65,36.2 6.82,36.2 5.55,37.47 5.55,44.29 4.28,45.56 4.28,50.16 v2.06,52.39
N$4  (via drill 0.61)
  Top 0.406: v4.6,52.7 R4.2
  Bottom 0.406: U1.18 27.14,41.27 21.42,46.99 18.57,46.99 17.61,46.04 15.07,46.04 8.41,52.7 v4.6,52.7
N$5  (via drill 0.61)
  Top 0.406: v6.82,54.29 6.82,57.57 R5.2
  Bottom 0.406: U1.8 19.52,27.3 28.41,36.2 28.41,41.27 22.69,46.99 22.69,48.58 21.42,49.85 20.15,49.85 17.3,46.99 15.39,46.99 8.41,53.98 7.14,53.98 v6.82,54.29
N$6
  Top 0.61: U1.15 33.49,40.32 33.49,44.13 35.71,46.35 43.01,46.35 44.28,47.62 44.28,55.56 43.33,56.52 R6.2
N$7  (via drill 0.61)
  Top 0.61: R7.2 46.19,56.94 46.19,46.35 v45.87,46.04
  Bottom 0.406: U1.14 35.71,23.81 36.03,24.13 36.03,28.89 37.93,30.8 37.93,32.23 39.2,33.5 41.9,33.5 46.19,37.78 46.19,45.72 v45.87,46.04
N$8
  Top 0.61: U1.17 32.54,41.91 32.54,44.45 35.39,47.31 38.25,47.31 39.84,48.9 39.84,56.2 40.79,57.15 R8.2
N$9
  Top 0.61: R19.1 35.2,43.14 36.03,43.97 41.74,43.97 42.7,43.02 R17.1 45.24,43.02
N$10
  Top 0.305: 8.41,8.1 8.41,10 9.84,11.43 9.84,13.02 10.15,13.34 11.26,13.34 12.85,11.75 16.6,11.75 C15.+
  Top 0.406: AUDIOIN.P$2 16.7,5.36 15.39,6.67 9.84,6.67 8.41,8.1
N$11  (via drill 0.61)
  Top 0.61: v25.71,22.07 25.71,20.94 R36.2
  Bottom 0.406: v25.71,22.07 25.71,19.68 26.19,19.21 26.19,17.46 25.23,16.51 25.23,10.79 24.44,10 22.06,10 21.27,10.79 21.27,11.11 20.79,11.59 19.11,11.59 C15.-
N$12
  Top 0.406: R13.1 41.17,86.95 U2.1 | R14.2 R13.1 | U2.4 38.41,81.92 37.46,82.87 37.46,89.53 38.41,90.49 40.47,90.49 41.11,89.85 41.11,87.95 41.03,87.87 | 41.03,87.87 40.95,87.79 | R13.1 41.11,87.79 41.03,87.87
N$13
  Top 0.406: R5.1 7.14,65.56 5.71,66.99 5.71,71.12 7.14,72.55 7.14,79.69 8.09,80.64 U3.12
N$14
  Top 0.406: R4.1 4.6,71.28 6.34,73.03 6.34,83.03 4.91,84.45 U3.2
N$15
  Top 0.406: R3.1 2.06,80.01 2.69,80.64 U3.5
N$16  (via drill 0.61)
  Top 0.406: 23.31,76.5 U4.3 22.86,76.52 21.11,74.77 v19.84,74.77 | R2.1 15.87,58.42 v17.14,59.69
  Bottom 0.406: v19.84,74.77 19.84,74.61 16.98,71.75 15.55,71.75 14.12,70.33 14.12,66.36 17.14,63.34 v17.14,59.69
N$17  (via drill 0.61)
  Top 0.406: U2.12 43.81,80.64 42.86,79.69 42.86,76.52 47.62,71.75 v47.62,65.72 | R8.1 40.79,59.69 43.33,62.23 v43.33,65.09
  Bottom 0.406: v43.33,65.09 46.98,65.09 v47.62,65.72
N$18
  Top 0.406: R62.1 38.09,60.8 37.62,61.28 37.68,61.28 R21.2
N$19  (via drill 0.61)
  Top 0.305: IC1.2 23.49,7.14 v23.96,6.67 | R63.1 30,6.19 v29.68,5.87
  Top 0.406: R62.2 38.09,56.04 v37.46,55.4
  Bottom 0.305: v23.96,6.67 24.6,6.03 29.52,6.03 v29.68,5.87
  Bottom 0.406: v37.46,55.4 34.76,55.4 33.65,56.52 33.65,61.91 34.76,63.02 40.63,63.02 41.9,61.75 41.9,57.15 47.94,51.12 47.94,37.15 38.73,27.94 38.73,17.14 32.06,10.48 32.06,8.1 29.84,5.87 v29.68,5.87
N$20  (via drill 0.61)
  Top 0.406: R20.1 10.63,41.38 10.63,36.99 13.17,34.45 v13.17,33.5 | R34.1 18.73,21.27 v18.57,21.43 | R18.2 v6.18,46.99
  Bottom 0.305: v13.17,33.5 13.17,21.59 13.33,21.43 v18.57,21.43
  Bottom 0.406: v6.18,46.99 8.72,46.99 9.84,45.88 9.84,42.23 9.82,42.23 R20.1
N$21
  Top 0.406: R7.1 45.87,72.55 42.22,76.2 42.22,83.66 41.43,84.45 U2.2
N$22
  Top 0.406: R6.1 43.33,60.17 45.24,62.07 45.24,72.23 41.59,75.88 41.59,80.17 41.11,80.64 U2.5
N$23  (via drill 0.61)
  Top 0.305: 21.9,8.41 IC1.1 23.65,8.41 v23.96,8.1 | R63.2 29.82,8.43 29.2,9.05 v29.2,9.53
  Top 0.406: R56.1 R63.2
  Bottom 0.305: v23.96,8.1 27.77,8.1 v29.2,9.53
N$24  (via drill 0.61)
  Top 0.406: 9.84,83.19 U3.14 11.42,83.19 12.59,84.35 R12.1 12.59,88.84 11.26,90.17 v11.26,93.34 | U2.3 38.57,83.19 38.09,83.66 38.09,86.68 39.2,87.79 R13.2 39.47,88.96 v39.05,89.38
  Bottom 0.406: v39.05,89.38 39.05,93.03 37.78,94.3 12.22,94.3 v11.26,93.34
N$25
  Top 0.406: U3.13 8.57,81.92 8.09,82.39 8.09,83.98 8.57,84.45 | 8.57,84.45 U3.15 10.95,84.45 11.58,85.09 11.58,86.52 10.89,87.21 R12.2 | R11.1 7.67,85.35 8.57,84.45
N$26
  Top 0.305: R10.1 0.68,81.54 0.47,81.76 0.47,85.25 0.95,85.72
  Top 0.406: U3.4 1.9,81.92 1.42,81.44 R10.1 | R11.2 4.91,87.79 3.75,86.62 U3.1 0.95,85.72
N$27  (via drill 0.61)
  Top 0.305: 25.23,72.39 23.33,72.39
  Top 0.406: R10.2 1.57,83.19 U3.3 5.07,83.19 5.71,82.55 5.71,74.14 v5.23,73.66 | R9.1 25.13,75.14 | U4.4 25.13,75.75 25.13,75.14 | 25.13,75.14 25.08,75.09 25.08,74.77 25.55,74.3 25.55,72.71 25.23,72.39 | 23.33,72.39 22.06,73.66 17.3,73.66 v17.14,73.5
  Bottom 0.406: v17.14,73.5 17.14,73.03 16.66,72.55 6.34,72.55 v5.23,73.66
N$28  (via drill 0.61)
  Top 0.305: 27.77,14.29 27.93,14.29 v28.89,13.34 | v30.47,20.8 30.47,21.59 30.95,22.07 30.95,25.4 26.19,30.16 20,30.16 v19.84,30 | v14.12,30.16 10.15,30.16 8.09,32.23 8.09,42.39 10.15,44.45 10.15,53.98 10.95,54.77 10.95,58.42 11.42,58.9 13.07,58.9 R1.1 | U4.1 24.13,78.42 24.28,78.26 24.28,76.04 23.65,75.41 23.65,75.14 | 14.12,58.48 14.12,58.9 14.76,59.53 15.39,59.53 16.34,60.48
  Top 0.406: U5.5 27.77,14.29 | 23.65,75.14 R9.2 23.43,74.19 v24.28,73.34 | v24.28,64.45 24.28,64.14 23.65,63.5 19.36,63.5 18.73,64.14 17.77,64.14 16.34,62.71 16.34,60.48 | 14.12,58.48 R1.1
  Bottom 0.305: v28.89,13.34 28.89,13.18 29.84,12.22 30.79,12.22 31.74,13.18 31.74,16.99 30.95,17.78 30.95,20.32 v30.47,20.8 | v14.12,30.16 14.44,29.84 19.68,29.84 v19.84,30
  Bottom 0.406: v24.28,73.34 v24.28,64.45
N$29
  Top 0.406: OK2.1 19.84,48.26 18.57,46.99 R40.1
N$30
  Top 0.813: U$2.14 U$2.13
N$31  (via drill 0.61)
  Top 0.305: R30.1 19.5,83.81 20.15,84.45 v20.15,85.41 | 29.36,81.28 36.03,81.28 36.98,80.33 36.98,73.34 v34.92,71.28
  Top 0.406: 29.04,80.96 29.04,79.38 28.09,78.42 U4.6 | 29.04,80.96 29.04,81.28 | 29.04,81.28 29.04,81.6 | 29.04,81.6 29.04,82.55 v28.73,82.87 | U6.1 22.06,72.39 22.69,71.75 25.71,71.75 26.35,72.39 26.35,73.18 26.82,73.66 29.84,73.66 v32.22,71.28 | 29.36,81.28 29.04,81.28 | 29.36,81.28 29.04,81.6 | 29.36,81.28 29.04,80.96
  Top 0.61: R44.2 R30.1
  Bottom 0.305: v20.15,85.41 20.79,84.77 27.14,84.77 28.73,83.19 v28.73,82.87 | v34.92,71.28 v32.22,71.28
N$32  (via drill 0.61)
  Top 0.406: R45.2 v17.61,89.85 | U3.9 9.89,76.62 10.31,76.2 v13.8,76.2 13.8,73.03 15.07,71.75 18.57,71.75 19.2,71.12 26.19,71.12 27.46,72.39 U6.18
  Top 0.61: R29.1 R45.2
  Bottom 0.406: v17.61,89.85 18.57,88.9 18.57,81.6 16.98,80.01 16.98,78.74 14.44,76.2 v13.8,76.2
N$33
  Top 0.406: R46.2 22.69,96.52 23.01,96.2 23.01,85.41 17.61,80.01 17.61,78.42 16.66,77.47 12.22,77.47 11.58,78.11 U3.10 8.72,78.11 8.41,77.79 8.41,74.61 12.22,70.8 18.25,70.8 18.88,70.17 18.88,69.22 19.52,68.58 25.87,68.58 27.14,69.85 U6.17
  Top 0.61: R28.1 R46.2
N$34  (via drill 0.61)
  Top 0.406: R27.1 25.87,85.09 23.01,82.23 v22.38,82.23 | v11.9,79.38 U3.11 8.41,79.38 7.77,78.74 7.77,73.98 15.71,66.04 25.87,66.04 27.14,67.31 U6.16
  Top 0.61: R47.2 R27.1
  Bottom 0.406: v11.9,79.38 11.9,75.88 12.85,74.93 14.12,74.93 17.61,78.42 17.61,79.38 20.47,82.23 v22.38,82.23
N$35  (via drill 0.61)
  Top 0.406: U2.9 46.09,76.42 v45.24,75.56 | R48.2 v32.22,89.22
  Top 0.61: R26.1 R48.2
  Bottom 0.406: v45.24,75.56 41.43,75.56 39.84,77.15 34.44,77.15 | v32.22,89.22 32.22,83.82 30.95,82.55 30.95,80.64 34.12,77.47 | 34.12,77.47 34.44,77.15 | 34.12,76.83 30.47,73.18 30.47,65.25 30,64.77 U6.15 | 34.12,76.83 34.44,77.15 | 34.12,76.83 34.12,77.47
N$36  (via drill 0.61)
  Top 0.406: U2.10 44.28,78.11 v43.97,77.79 | R49.2 v32.22,82.23 32.54,81.92 36.35,81.92 37.62,80.64 37.62,68.9 30.95,62.23 U6.14
  Top 0.61: R25.1 R49.2
  Bottom 0.406: v43.97,77.79 34.76,77.79 32.22,80.33 v32.22,82.23
N$37  (via drill 0.61)
  Top 0.305: U2.11 47.14,79.38 47.46,79.06 v47.46,74.61 | v35.39,75.88 R24.1
  Top 0.406: R50.2 35.38,78.41 35.39,78.42 R24.1
  Bottom 0.305: v47.46,74.61 36.66,74.61 v35.39,75.88 34.44,75.88 31.11,72.55 31.11,60.48 30.31,59.69 U6.13
N$38  (via drill 0.61)
  Top 0.254: v18.25,25.4 18.25,22.7 17.61,22.07 17.61,20.8 18.41,20 18.41,18.73 18.73,18.41 19.2,18.41 19.52,18.1 U5.1
  Top 0.406: v14.12,28.57 8.72,28.57 5.55,31.75 5.55,41.58 R35.2 5.53,42.95 R18.1
  Bottom 0.406: v18.25,25.4 18.25,27.62 17.3,28.57 v14.12,28.57
N$39
  Top 0.305: R32.2 19.19,17.48 20.47,16.19 20.47,15.56
  Top 0.406: U5.3 20.47,15.56 19.84,14.92 R33.2
N$40  (via drill 0.61)
  Top 0.406: U5.2 23.33,16.83 23.65,17.14 23.65,18.73 23.33,19.05 23.33,20.48 | 23.33,20.48 23.65,20.8 | 24.28,20.95 R36.1 23.65,20.8 | 23.33,20.48 23.33,21.11 | 23.33,21.11 23.33,25.4 22.06,26.67 v20.79,26.67 | 23.65,20.8 23.33,21.11 | R20.2 12.3,41.83 13.17,40.96 13.17,36.35 14.44,35.08 14.44,33.81 v14.76,33.5 | v25.55,31.91 v19.84,31.91
  Top 0.61: R20.2 R20.3
  Bottom 0.305: v14.76,33.5 14.76,32.86 15.71,31.91 v19.84,31.91
  Bottom 0.406: v20.79,26.67 20.79,27.46 25.23,31.91 v25.55,31.91
N$41  (via drill 0.61)
  Top 0.406: F1.1 v40.64,27.79 v40.63,27.78
  Top 0.813: U$2.11 U$2.12
  Bottom 0.61: U$2.11 48.73,15.24 49.36,15.88 49.36,25.08 48.09,26.35 41.43,26.35 40.63,27.15 v40.63,27.78
N$42
  Top 0.406: R64.2 9.53,58.91 11.9,61.28 12.32,61.28 | 12.38,61.28 12.32,61.28 | 12.32,61.28 R23.2
N$43
  Top 0.406: R31.1 25.23,12.38 24.92,12.7 24.92,15.56 26.19,16.83 U5.7 28.73,16.83 29.2,16.35 29.94,16.35 R38.2
N$44
  Top 0.406: R38.1 30,14.76 31.58,14.76 34.28,12.06 C10.1
N$45
  Bottom 0.61: U1.6 U1.7
N$46
  Top 0.406: 24.6,10.79 24.6,11.43
N$47  (via drill 0.61)
  Top 0.305: v13.8,10.16 13.8,9.68 16.82,6.67 18.25,6.67 v18.41,6.51
  Top 0.406: R64.1 9.04,54.93 2.85,48.74 1.74,48.74 0.95,47.94 0.95,46.2 v1.74,45.4 | IC1.6 19.85,2.06 R65.2 19.22,2.24 v18.41,1.43
  Bottom 0.305: 9.36,12.54 9.36,12.38 10.31,11.43 12.69,11.43 13.8,10.32 v13.8,10.16 | v18.41,6.51 19.68,5.24 19.68,3.33 18.41,2.06 v18.41,1.43
  Bottom 0.406: v1.74,45.4 1.9,45.24 1.9,41.91 0.47,40.48 0.47,29.37 3.01,26.83 3.01,20.48 9.36,14.13 9.36,12.54
N$48  (via drill 0.61)
  Top 0.406: R23.3 13.23,59.69 11.26,59.69 10.31,58.74 10.31,55.24 2.22,47.15 v2.06,47.15
  Bottom 0.406: CRUSH_CV.P$2 7.9,19.72 5.55,22.07 5.55,32.07 3.01,34.61 3.01,46.2 v2.06,47.15
N$49
  Top 0.254: R65.1 19.5,0.94 19.04,0.48 17.93,0.48 17.46,0.95 17.46,1.75 19.36,3.65 19.36,6.99 18.57,7.78 R53.2
  Top 0.406: IC1.7 19.82,0.79 R65.1
N$51
  Top 0.406: 45.24,27.62 F2.1 44.44,26.99 44.44,22.86 43.17,21.59 40.95,21.59 | U$2.10 43.01,12.7 42.06,13.65 42.06,15.56 41.11,16.51 39.52,16.51 38.57,17.46 38.57,20.64 39.52,21.59 40,21.59 | 40,21.59 40.95,21.59 | 40.47,22.07 40,21.59 | 40.95,21.59 40.47,22.07 | 40.47,22.07 C18.+
  Top 0.813: U$2.9 U$2.10
N$52
  Top 0.305: U7.5 5.29,13.97 6.18,13.97 6.96,13.19 C5.2
  Top 0.61: 5.23,13.97 U7.5
N$53
  Top 0.406: R43.1 17.31,75.9 18.25,76.83 LED1.K
N$54
  Top 0.305: U7.3 3.96,9.84 5.23,11.11 8.72,11.11 9.2,11.59 9.2,15.72 9.68,16.19
  Top 0.406: U1.10 24.6,25.4 22.22,27.78 17.77,27.78 15.71,25.72 15.71,22.23 9.68,16.19 | U7.3 3.96,8.89
N$55
  Top 0.406: U5.6 25.87,15.56 25.55,15.24 25.55,13.65 25.87,13.34 26.82,13.34 27.15,13 R31.2 27.15,11.13 27.14,11.11 R51.1
N$56
  Top 0.61: R44.1 16.68,85.11 16.34,84.77 16.34,83.82 15.71,83.19 14.44,83.19 14.4,83.22 LED2.K
N$57
  Top 0.61: R45.1 16.68,92.72 16.03,92.08 16.03,90.49 15.39,89.85 14.41,89.85 LED3.K
N$58
  Top 0.61: R46.1 21.76,97.81 20.15,96.2 19.43,96.2 LED4.K
N$59
  Top 0.61: R47.1 28.08,97.81 29.68,96.2 30.57,96.2 LED5.K
N$60
  Top 0.61: R48.1 33.16,92.09 33.49,91.76 33.49,90.49 34.12,89.85 35.39,89.85 35.41,89.84 LED6.K
N$61
  Top 0.61: R49.1 33.16,85.11 33.49,84.77 33.49,83.82 34.12,83.19 35.54,83.19 LED7.K
N$62
  Top 0.406: LED8.K 31.9,76.83 32.54,77.47 32.54,79.06 33.19,79.71 R50.1
N$63
  Top 0.305: U1.26 6.82,41.58 R35.1 6.83,42.08 7.93,43.18 7.93,46.83 6.66,48.1 5.23,48.1 3.01,45.88 D6.3
N$65
  Top 0.406: R14.1 45.61,87.37 44.28,86.04 44.28,84.77 44.6,84.45 44.76,84.45 | 44.76,84.45 U2.15 | R15.2 48.2,81.92 U2.13 44.6,81.92 44.28,82.23 44.28,83.98 44.76,84.45
N$68
  Top 0.61: C16.+ 22.12,20.89 21.74,21.27 R34.2
N$70
  Top 0.406: U$2.1 49.05,2.54 49.36,2.86 49.36,26.99 48.41,27.94 48.25,27.94 F3.2
  Top 0.813: U$2.2 U$2.1
N$71
  Top 0.254: 27.14,7.14 IC1.13 28.57,7.14 28.73,6.99 28.73,5.08 29.04,4.76 30.16,4.76 30.63,5.24 30.63,6.35 31.11,6.83 R56.2
  Top 0.406: R56.2 R55.1 32.84,7.13 33.49,7.78 33.49,9.53 32.85,10.16 32.22,10.16 R59.2 R60.2
N$72  (via drill 0.61)
  Top 0.406: R59.1 32.22,12.06 31.11,13.18 v30.31,13.18
  Bottom 0.305: v30.31,13.18 30.31,18.89 29.2,20 26.82,20 26.5,20.32 26.5,21.59 26.82,21.91 27.77,21.91 28.41,22.54
  Bottom 0.406: 28.41,22.54 28.41,32.07 30.31,33.97 34.12,33.97 37.3,37.15 37.3,41.81 R19.2
N$73  (via drill 0.61)
  Top 0.305: IC1.14 27.2,8.79 27.93,9.53 v27.93,10 28.57,10.64 29.84,10.64 30.16,10.32 30.16,9.53 30.47,9.21 32.06,9.21 32.22,9.05 R55.2
  Top 0.406: R52.2 37.3,19.05 v36.98,18.73
  Bottom 0.406: v36.98,18.73 36.98,16.35 31.27,10.64 28.57,10.64 v27.93,10
N$75
  Bottom 0.61: SAMP_CV.P$2 33.39,19.05 34.12,19.05 37.93,22.86 37.93,28.26 47.14,37.47 47.14,50.8 40.2,57.74 R21.3
N$79
  Top 0.406: U6.7 20,57.15 18.88,58.26 18.03,58.26 R54.2
N$80  (via drill 0.61)
  Top 0.254: 12.53,48.74 16.03,45.24 16.03,42.7 18.25,40.48
  Top 0.305: 18.25,40.48 18.25,33.97 16.82,32.54 11.11,32.54 v9.68,33.97 | v10.79,12.38 11.26,12.38 12.53,11.11 14.92,11.11 15.87,10.16 19.2,10.16 20,9.37 R61.1
  Top 0.406: 12.53,48.74 12.53,57.47 12.22,57.78 v11.9,57.78 | C17.2 18.87,60.31 U6.5
  Bottom 0.406: v11.9,57.78 12.22,58.1 17.93,58.1 18.73,58.9 18.73,60.17 U6.5 | v9.68,33.97 8.09,32.38 8.09,22.23 10.31,20 10.31,12.86 v10.79,12.38
N$81  (via drill 0.61)
  Top 0.254: 18.57,13.02 19.04,12.54 19.84,12.54 20.31,12.06 v20.31,10.48 | v17.14,9.05 18.39,9.05 R53.1
  Top 0.305: R57.1 18.57,13.02 | v25.08,2.7 25.71,2.06 IC1.9 28.09,2.06 28.89,1.27 R41.2 29.82,1.57 30.79,2.54 30.81,2.54 R58.1
  Bottom 0.254: v17.14,9.05 17.14,9.53 17.61,10 19.84,10 v20.31,10.48
  Bottom 0.305: v25.08,2.7 24.44,2.7 20.79,6.35 20.79,10 v20.31,10.48
N$82  (via drill 0.61)
  Top 0.406: R40.2 18.57,42.86 19.52,41.91 21.42,41.91 v21.74,41.59 | D4.3 26.82,45.4 24.92,43.5 v24.92,41.59 25.87,40.64 25.87,35.24 34.61,26.5 R52.1
  Bottom 0.406: v21.74,41.59 v24.92,41.59
N$83  (via drill 0.61)
  Top 0.305: v12.06,16.99 12.53,16.51 15.07,16.51 17.14,14.45 18.55,14.45 R57.2
  Top 0.406: v11.42,53.34 v11.42,46.83 | v16.34,33.5 16.34,35.4 15.71,36.04 v15.71,37.15
  Bottom 0.305: v12.06,16.99 12.06,20.64 10.63,22.07 10.63,26.04 11.9,27.3 11.9,33.81 12.53,34.45 15.39,34.45 v16.34,33.5
  Bottom 0.406: v11.42,46.83 11.42,46.67 13.8,44.29 15.87,44.29 16.66,43.5 16.66,41.59 15.71,40.64 v15.71,37.15
  Bottom 0.61: v11.42,53.34 22.22,53.34 23.01,54.13 23.01,78.11 25,80.09 R22.2
N$85
  Top 0.406: U2.14 48.2,83.19 R15.1 49.31,83.4 49.52,83.19 49.52,60.06 R16.1
OUT
  Top 0.406: 42.39,9.84 42.39,4.55 AUDIOOUT.P$2 | C10.2 37.3,12.06 39.52,9.84 41.74,9.84 | 41.74,9.84 42.39,9.84 | 42.38,9.21 41.74,9.84 | 42.38,10.48 41.74,9.84 | R37.2 42.39,9.84
PWR_BUS
  Top 0.813: U$2.16 U$2.15
Y  (via drill 0.61)
  Top 0.305: v27.14,36.51 30.31,36.51 v30.95,35.88
  Top 0.406: U7.7 2.69,12.06 v2.37,11.75 | v30.95,35.88 30.95,32.38 34.46,28.88 R42.1 | v0.95,26.51 14.6,26.51 16.19,28.1 v16.19,30.96
  Top 0.61: U7.7 R39.2
  Bottom 0.305: v16.19,30.96 22.22,30.96 27.14,35.88 v27.14,36.51
  Bottom 0.406: v30.95,35.88 30.95,40.64 30,41.59 29.04,41.59 28.41,42.23 OK2.4 | v2.37,11.75 2.37,19.37 0.47,21.27 0.47,26.04 v0.95,26.51
Z  (via drill 0.61)
  Top 0.305: 7.93,15.72 4.28,15.72
  Top 0.406: U7.2 2.69,10.16 3.96,11.43 U7.6 3.96,15.4 4.28,15.72 4.28,17.78 4.6,18.1 C4.2 | 7.93,15.72 13.17,20.95 13.17,25.24 13.8,25.88 14.92,25.88 17.46,28.42 v23.65,28.42 | R42.2 34.74,30.18 33.17,31.75 v33.17,35.88
  Bottom 0.406: OK2.6 28.41,47.94 33.49,42.86 33.49,37.78 33.17,37.47 v33.17,35.88 32.06,34.77 30,34.77 v23.65,28.42

### Text on the board
tPlace: Bit Reactor v1.3 | Rebel Technology | R46 | R28 | R27 | R47 | R45 | R29 | R26 | R48 | C11 | C7 | R11 | R12 | R13 | R14 | R22 | R44 | R49 | R10 | R30 | R25 | R24 | R15 | U4 | R43 | U3 | R50 | U2 | R9 | C12 | U6 | R23 | R21 | C17 | R3 | R4 | R5 | R1 | R2 | R64 | R62 | R8 | R6 | R7 | R54 | R16 | R20 | R19 | R40 | U8 | D4 | R18 | D5 | R17 | R35 | D3 | D2 | F1 | F2 | F3 | U1 | R42 | R52 | D1 | R39 | R36 | C13 | C4 | R34 | C2 | C9 | R32 | U5 | R38 | R57 | C14 | R31 | R33 | R37 | U7 | R51 | C10 | C5 | R60 | R59 | C6 | R63 | R55 | R53 | R61 | R56 | C3 | R65 | R58 | U9 | R41
bPlace: C8 | C18 | C16 | C15 | C1